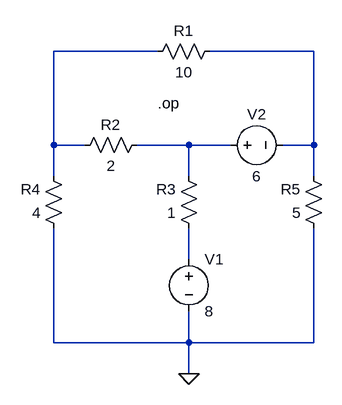
[diagram p0: schematic ej_semana_1.asc]
ej_semana_1.asc, the LTspice schematic file:
Version 4
SHEET 1 880 680
WIRE 336 144 176 144
WIRE 576 144 416 144
WIRE 176 288 176 144
WIRE 224 288 176 288
WIRE 384 288 304 288
WIRE 448 288 384 288
WIRE 576 288 576 144
WIRE 576 288 528 288
WIRE 176 336 176 288
WIRE 384 336 384 288
WIRE 576 336 576 288
WIRE 384 464 384 416
WIRE 176 592 176 416
WIRE 384 592 384 544
WIRE 384 592 176 592
WIRE 576 592 576 416
WIRE 576 592 384 592
WIRE 384 640 384 592
FLAG 384 640 0
SYMBOL res 432 128 R90
WINDOW 0 0 56 VBottom 2
WINDOW 3 32 56 VTop 2
SYMATTR InstName R1
SYMATTR Value 10
SYMBOL res 320 272 R90
WINDOW 0 0 56 VBottom 2
WINDOW 3 32 56 VTop 2
SYMATTR InstName R2
SYMATTR Value 2
SYMBOL res 400 432 R180
WINDOW 0 36 76 Left 2
WINDOW 3 36 40 Left 2
SYMATTR InstName R3
SYMATTR Value 1
SYMBOL res 192 432 R180
WINDOW 0 36 76 Left 2
WINDOW 3 36 40 Left 2
SYMATTR InstName R4
SYMATTR Value 4
SYMBOL res 592 432 R180
WINDOW 0 36 76 Left 2
WINDOW 3 36 40 Left 2
SYMATTR InstName R5
SYMATTR Value 5
SYMBOL voltage 384 448 R0
SYMATTR InstName V1
SYMATTR Value 8
SYMBOL voltage 432 288 R270
WINDOW 0 32 56 VTop 2
WINDOW 3 -32 56 VBottom 2
SYMATTR InstName V2
SYMATTR Value 6
TEXT 336 224 Left 2 !.op

The netlist it stands for:
* ej_semana_1.asc
R1 N002 N001 10
R2 N003 N001 2
R3 N004 N003 1
R4 0 N001 4
R5 0 N002 5
V1 N004 0 8
V2 N003 N002 6
.op
.backanno
.end